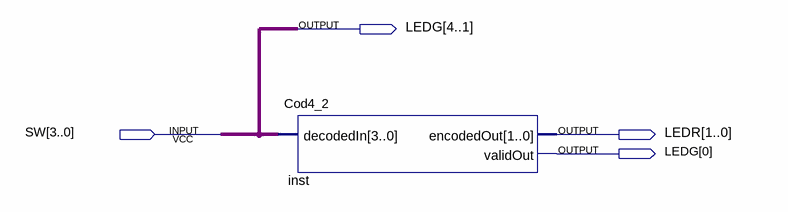
[diagram p0: schematic sheet]
// Quartus schematic PEnc4_2Demo.bdf as structural Verilog: 1 symbols, 4 pins
module PEnc4_2Demo (
  input  [3:0] SW,
  output [4:0] LEDG,
  output [1:0] LEDR
);

  Cod4_2 inst (.decodedIn(SW), .encodedOut(LEDR), .validOut(LEDG[0]));

  assign LEDG[4:1] = SW;
endmodule
